# EAGLE design Chroma-Color_Rails (EAGLE 6.5.0)
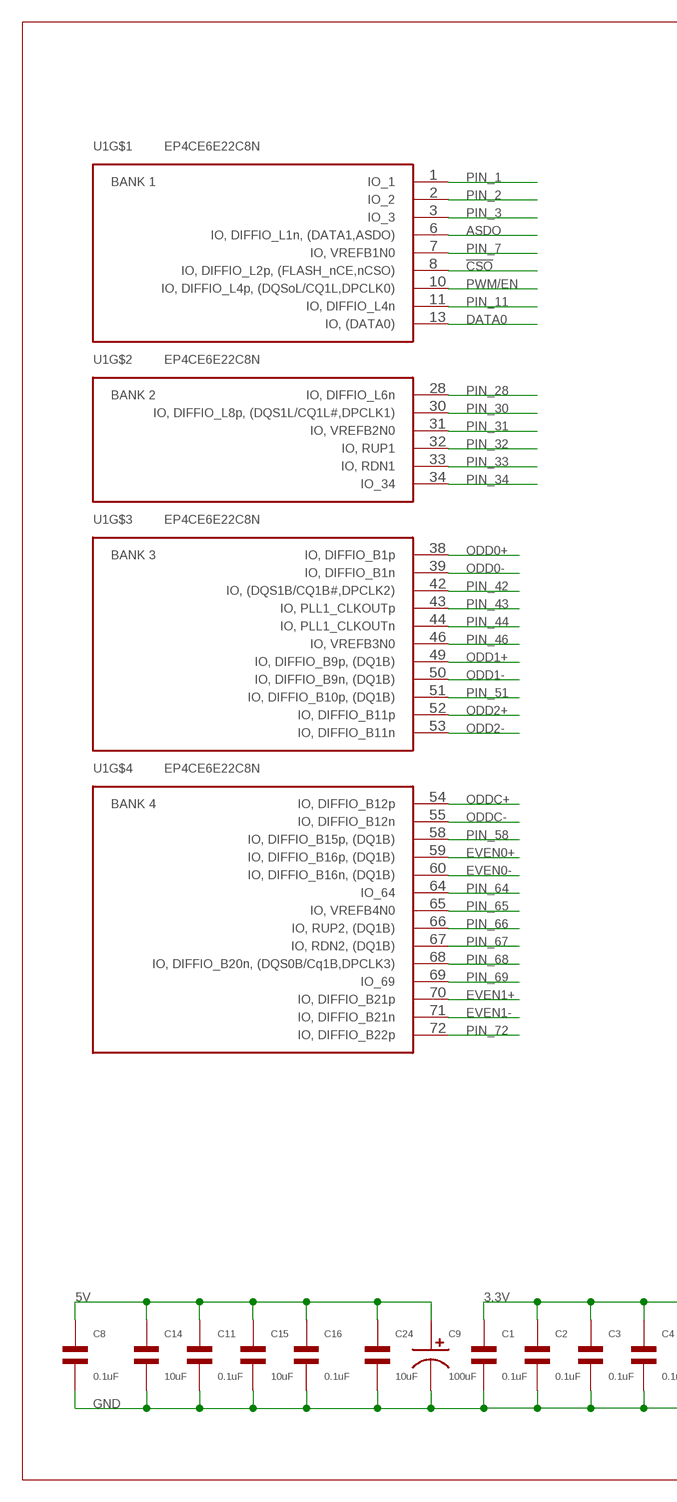
[diagram p0: schematic, sheet 1, part 1 of 2]
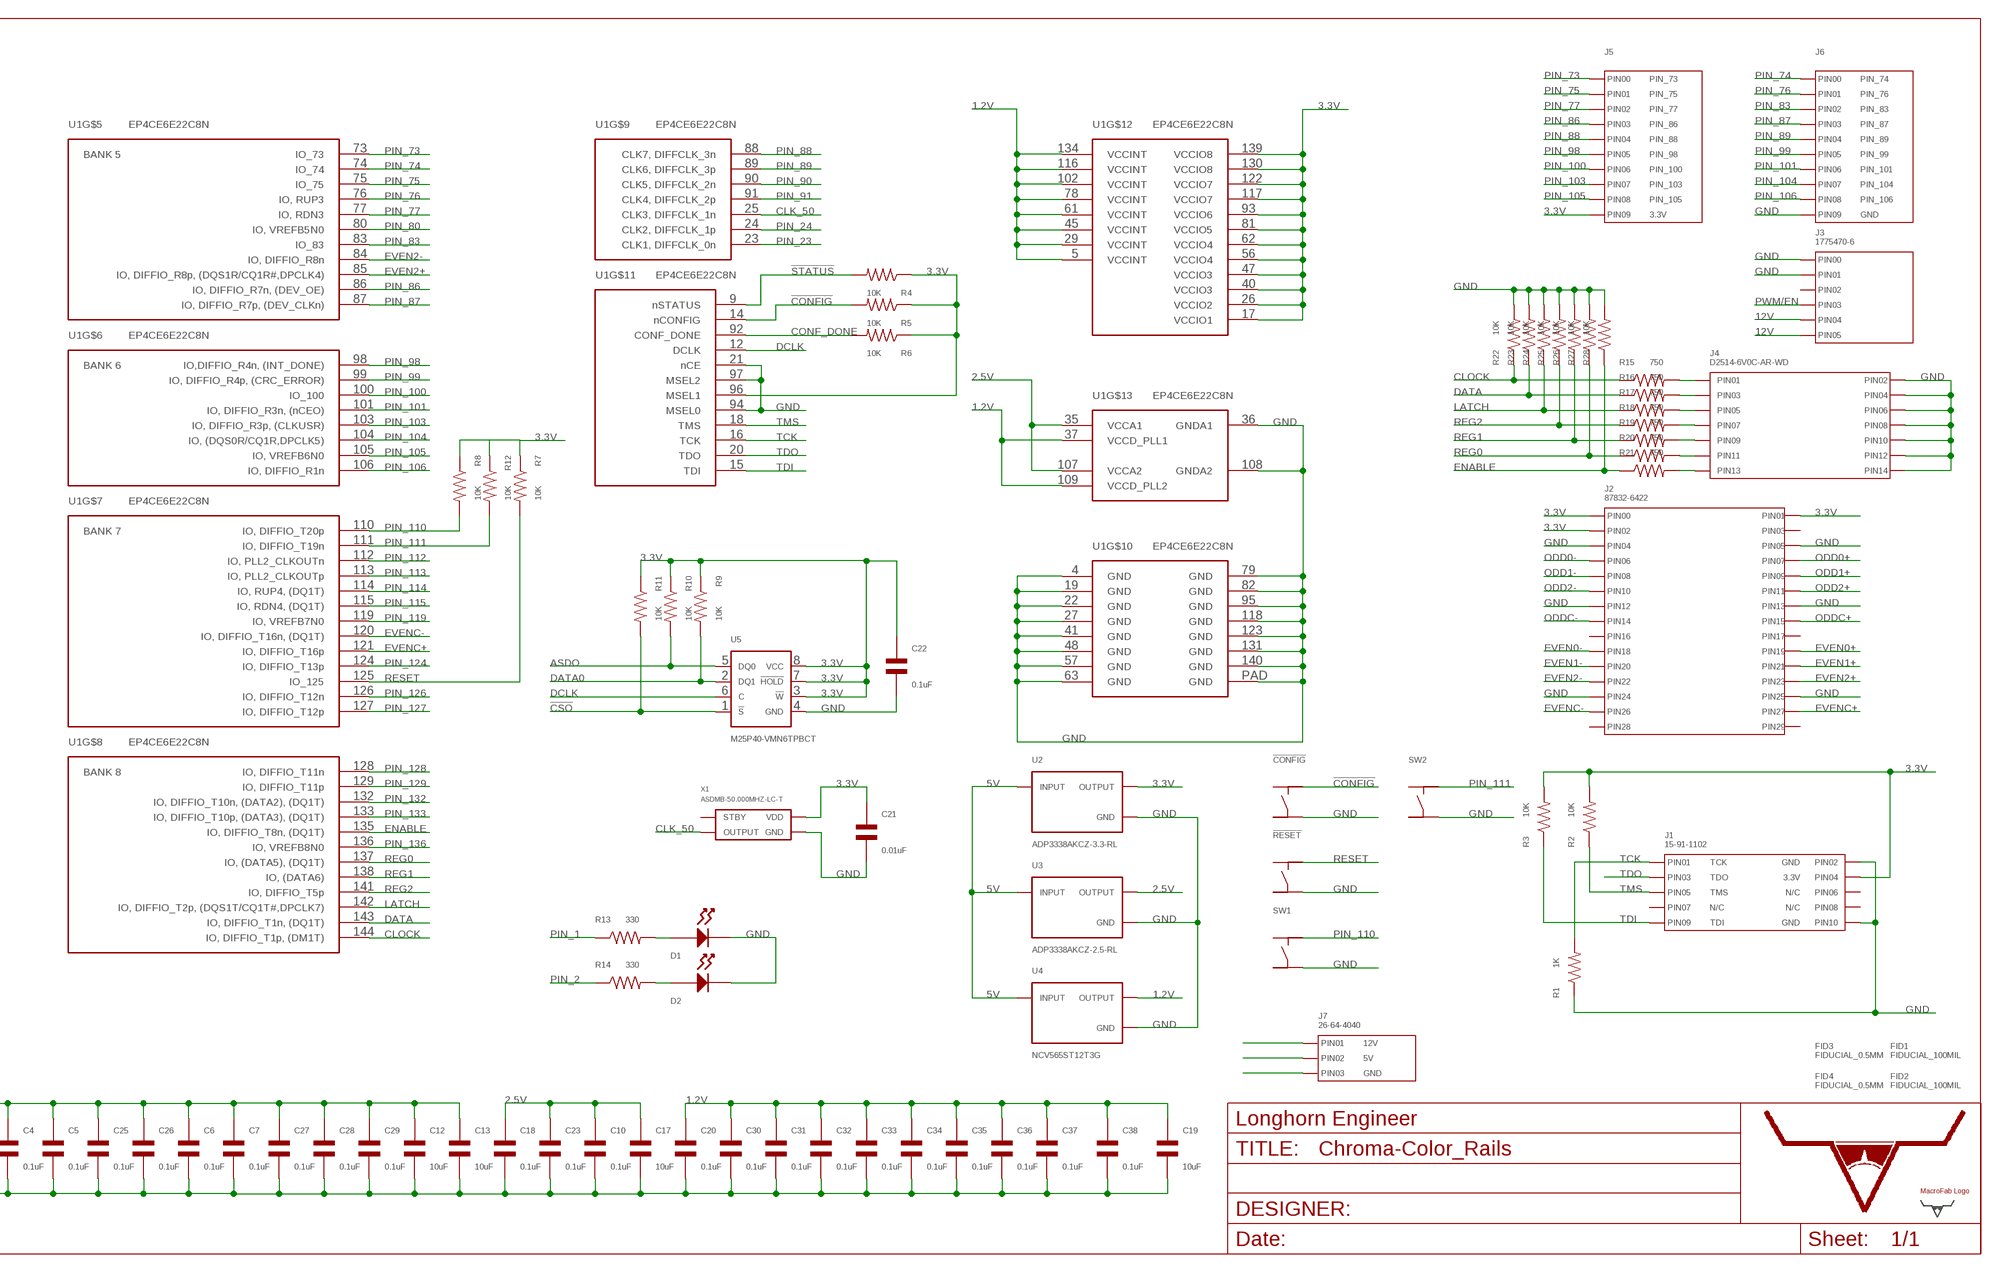
[diagram p1: schematic, sheet 1, part 2 of 2]

## Parts
!CONFIG  TACT_4.2MM  [TACT4.2MM]
!RESET  TACT_4.2MM  [TACT4.2MM]
C1  0.1uF  CAPACITOR_NP_0603  [C0603]
C2  0.1uF  CAPACITOR_NP_0603  [C0603]
C3  0.1uF  CAPACITOR_NP_0603  [C0603]
C4  0.1uF  CAPACITOR_NP_0603  [C0603]
C5  0.1uF  CAPACITOR_NP_0603  [C0603]
C6  0.1uF  CAPACITOR_NP_0603  [C0603]
C7  0.1uF  CAPACITOR_NP_0603  [C0603]
C8  0.1uF  CAPACITOR_NP_0603  [C0603]
C9  100uF  CAPACITOR_P_6.3MM  [CP6.3MM]
C10  0.1uF  CAPACITOR_NP_0603  [C0603]
C11  0.1uF  CAPACITOR_NP_0603  [C0603]
C12  10uF  CAPACITOR_NP_0603  [C0603]
C13  10uF  CAPACITOR_NP_0603  [C0603]
C14  10uF  CAPACITOR_NP_0603  [C0603]
C15  10uF  CAPACITOR_NP_0603  [C0603]
C16  0.1uF  CAPACITOR_NP_0603  [C0603]
C17  10uF  CAPACITOR_NP_0603  [C0603]
C18  0.1uF  CAPACITOR_NP_0603  [C0603]
C19  10uF  CAPACITOR_NP_0603  [C0603]
C20  0.1uF  CAPACITOR_NP_0603  [C0603]
C21  0.01uF  CAPACITOR_NP_0603  [C0603]
C22  0.1uF  CAPACITOR_NP_0603  [C0603]
C23  0.1uF  CAPACITOR_NP_0603  [C0603]
C24  10uF  CAPACITOR_NP_0603  [C0603]
C25  0.1uF  CAPACITOR_NP_0603  [C0603]
C26  0.1uF  CAPACITOR_NP_0603  [C0603]
C27  0.1uF  CAPACITOR_NP_0603  [C0603]
C28  0.1uF  CAPACITOR_NP_0603  [C0603]
C29  0.1uF  CAPACITOR_NP_0603  [C0603]
C30  0.1uF  CAPACITOR_NP_0603  [C0603]
C31  0.1uF  CAPACITOR_NP_0603  [C0603]
C32  0.1uF  CAPACITOR_NP_0603  [C0603]
C33  0.1uF  CAPACITOR_NP_0603  [C0603]
C34  0.1uF  CAPACITOR_NP_0603  [C0603]
C35  0.1uF  CAPACITOR_NP_0603  [C0603]
C36  0.1uF  CAPACITOR_NP_0603  [C0603]
C37  0.1uF  CAPACITOR_NP_0603  [C0603]
C38  0.1uF  CAPACITOR_NP_0603  [C0603]
D1  LED_SINGLE_0805  [LED0805]
D2  LED_SINGLE_0805  [LED0805]
FID1  FIDUCIAL_100MIL  [FIDUCIAL_100MIL]
FID2  FIDUCIAL_100MIL  [FIDUCIAL_100MIL]
FID3  FIDUCIAL_0.5MM  [FIDUCIAL_0.5MM]
FID4  FIDUCIAL_0.5MM  [FIDUCIAL_0.5MM]
J1  15-91-1102  [15-91-1102]
J2  87832-6422  [87832-6422]
J3  1775470-6  [1775470-6]
J4  D2514-6V0C-AR-WD  SMT_02X07D2514-6V0C-AR-WD  [D2514-6V0C-AR-WD]
J5  HEADER_01X10_PTH_2.54MM  [PTH_2.54MM_01X10]
J6  HEADER_01X10_PTH_2.54MM  [PTH_2.54MM_01X10]
J7  26-64-4040  HEADER_01X03MOLEX_KK_4_P1  [MOLEX_KK_4_P1]
R1  1K  RESISTOR_0603  [R0603]
R2  10K  RESISTOR_0603  [R0603]
R3  10K  RESISTOR_0603  [R0603]
R4  10K  RESISTOR_0603  [R0603]
R5  10K  RESISTOR_0603  [R0603]
R6  10K  RESISTOR_0603  [R0603]
R7  10K  RESISTOR_0603  [R0603]
R8  10K  RESISTOR_0603  [R0603]
R9  10K  RESISTOR_0603  [R0603]
R10  10K  RESISTOR_0603  [R0603]
R11  10K  RESISTOR_0603  [R0603]
R12  10K  RESISTOR_0603  [R0603]
R13  330  RESISTOR_0603  [R0603]
R14  330  RESISTOR_0603  [R0603]
R15  750  RESISTOR_0603  [R0603]
R16  750  RESISTOR_0603  [R0603]
R17  750  RESISTOR_0603  [R0603]
R18  750  RESISTOR_0603  [R0603]
R19  750  RESISTOR_0603  [R0603]
R20  750  RESISTOR_0603  [R0603]
R21  750  RESISTOR_0603  [R0603]
R22  10K  RESISTOR_0603  [R0603]
R23  10K  RESISTOR_0603  [R0603]
R24  10K  RESISTOR_0603  [R0603]
R25  10K  RESISTOR_0603  [R0603]
R26  10K  RESISTOR_0603  [R0603]
R27  10K  RESISTOR_0603  [R0603]
R28  10K  RESISTOR_0603  [R0603]
SW1  TACT_4.2MM  [TACT4.2MM]
SW2  TACT_4.2MM  [TACT4.2MM]
U1  EP4CE6E22C8N  [EQFP-144]
U2  ADP3338AKCZ-3.3-RL  [SOT-223B]
U3  ADP3338AKCZ-2.5-RL  [SOT-223B]
U4  NCV565ST12T3G  [SOT-223B]
U5  M25P40-VMN6TPBCT  [SOIC-8]
U$1  LHE_FRAME  [LHE_FRAME]
U$2  MF_LOGOLOGO_MEDIUM  [MF_LOGO_MEDIUM]
U$3  LHE_LOGOLHE_LOGO  [LHE_LOGO]
X1  ASDMB-50.000MHZ-LC-T  ASDMB  [ASDMB]

## Nets
1.2V: C19.P$1 C20.P$1 C30.P$1 C31.P$1 C32.P$1 C33.P$1 C34.P$1 C35.P$1 C36.P$1 C37.P$1 C38.P$1 U1.5 U1.29 U1.37 U1.45 U1.61 U1.78 U1.102 U1.109 U1.116 U1.134 U4.2(OUT) U4.PAD(OUT)
2.5V: C10.P$1 C17.P$1 C18.P$1 C23.P$1 U1.35 U1.107 U3.2(OUT) U3.PAD(OUT)
3.3V: C1.P$1 C2.P$1 C3.P$1 C4.P$1 C5.P$1 C6.P$1 C7.P$1 C12.P$1 C13.P$1 C21.P$1 C22.P$1 C25.P$1 C26.P$1 C27.P$1 C28.P$1 C29.P$1 J1.4(PIN4) J2.P$1(PIN0) J2.P$2(PIN1) J2.P$3(PIN2) J5.P$10(PIN9) R2.P$2 R3.P$2 R4.P$1 R5.P$1 R6.P$1 R7.P$1 R8.P$1 R9.P$1 R10.P$1 R11.P$1 R12.P$1 U1.17 U1.26 U1.40 U1.47 U1.56 U1.62 U1.81 U1.93 U1.96 U1.117 U1.122 U1.130 U1.139 U2.2(OUT) U2.PAD(OUT) U5.3(!W) U5.7(!HOLD) U5.8(VCC) X1.P$4(VDD)
5V: C8.P$1 C9.P$1 C11.P$1 C14.P$1 C15.P$1 C16.P$1 C24.P$1 J7.3(PIN2) U2.3(IN) U3.3(IN) U4.3(IN)
12V: J3.P$5(PIN4) J3.P$6(PIN5) J7.2(PIN1)
!CONFIG: !CONFIG.P$2 R5.P$2 U1.14
!CSO: R11.P$2 U1.8 U5.1(!S)
!STATUS: R4.P$2 U1.9
ASDO: R10.P$2 U1.6 U5.5(DQ0)
CLK_50: U1.25 X1.P$3(OUTPUT)
CLOCK: R15.P$1 R22.P$1 U1.144
CONF_DONE: R6.P$2 U1.92
DATA: R16.P$1 R23.P$1 U1.143
DATA0: R9.P$2 U1.13 U5.2(DQ1)
DCLK: U1.12 U5.6(C)
ENABLE: R21.P$1 R28.P$1 U1.135
EVEN0+: J2.P$20(PIN19) U1.59
EVEN0-: J2.P$19(PIN18) U1.60
EVEN1+: J2.P$22(PIN21) U1.70
EVEN1-: J2.P$21(PIN20) U1.71
EVEN2+: J2.P$24(PIN23) U1.85
EVEN2-: J2.P$23(PIN22) U1.84
EVENC+: J2.P$28(PIN27) U1.121
EVENC-: J2.P$27(PIN26) U1.120
GND: !CONFIG.P$4 !RESET.P$4 C1.P$2 C2.P$2 C3.P$2 C4.P$2 C5.P$2 C6.P$2 C7.P$2 C8.P$2 C9.P$2 C10.P$2 C11.P$2 C12.P$2 C13.P$2 C14.P$2 C15.P$2 C16.P$2 C17.P$2 C18.P$2 C19.P$2 C20.P$2 C21.P$2 C22.P$2 C23.P$2 C24.P$2 C25.P$2 C26.P$2 C27.P$2 C28.P$2 C29.P$2 C30.P$2 C31.P$2 C32.P$2 C33.P$2 C34.P$2 C35.P$2 C36.P$2 C37.P$2 C38.P$2 D1.CATHODE D2.CATHODE J1.2(PIN2) J1.10(PIN10) J2.P$5(PIN4) J2.P$6(PIN5) J2.P$13(PIN12) J2.P$14(PIN13) J2.P$25(PIN24) J2.P$26(PIN25) J3.P$1(PIN0) J3.P$2(PIN1) J4.2(PIN2) J4.4(PIN4) J4.6(PIN6) J4.8(PIN8) J4.10(PIN10) J4.12(PIN12) J4.14(PIN14) J6.P$10(PIN9) J7.4(PIN3) R1.P$1 R22.P$2 R23.P$2 R24.P$2 R25.P$2 R26.P$2 R27.P$2 R28.P$2 SW1.P$4 SW2.P$4 U1.4 U1.19 U1.21 U1.22 U1.27 U1.36 U1.41 U1.48 U1.57 U1.63 U1.79 U1.82 U1.94 U1.95 U1.97 U1.108 U1.118 U1.123 U1.131 U1.140 U1.PAD U2.1(GND) U3.1(GND) U4.1(GND) U5.4(GND) X1.P$2(GND)
LATCH: R17.P$1 R24.P$1 U1.142
N$1: D1.ANODE R13.P$2
N$2: D2.ANODE R14.P$2
N$3: J4.1(PIN1) R15.P$2
N$4: J4.3(PIN3) R16.P$2
N$5: J4.5(PIN5) R17.P$2
N$6: J4.7(PIN7) R18.P$2
N$7: J4.9(PIN9) R19.P$2
N$8: J4.11(PIN11) R20.P$2
N$9: J4.13(PIN13) R21.P$2
ODD0+: J2.P$8(PIN7) U1.38
ODD0-: J2.P$7(PIN6) U1.39
ODD1+: J2.P$10(PIN9) U1.49
ODD1-: J2.P$9(PIN8) U1.50
ODD2+: J2.P$12(PIN11) U1.52
ODD2-: J2.P$11(PIN10) U1.53
ODDC+: J2.P$16(PIN15) U1.54
ODDC-: J2.P$15(PIN14) U1.55
PIN_1: R13.P$1 U1.1
PIN_2: R14.P$1 U1.2
PIN_3: U1.3
PIN_7: U1.7
PIN_11: U1.11
PIN_23: U1.23
PIN_24: U1.24
PIN_28: U1.28
PIN_30: U1.30
PIN_31: U1.31
PIN_32: U1.32
PIN_33: U1.33
PIN_34: U1.34
PIN_42: U1.42
PIN_43: U1.43
PIN_44: U1.44
PIN_46: U1.46
PIN_51: U1.51
PIN_58: U1.58
PIN_64: U1.64
PIN_65: U1.65
PIN_66: U1.66
PIN_67: U1.67
PIN_68: U1.68
PIN_69: U1.69
PIN_72: U1.72
PIN_73: J5.P$1(PIN0) U1.73
PIN_74: J6.P$1(PIN0) U1.74
PIN_75: J5.P$2(PIN1) U1.75
PIN_76: J6.P$2(PIN1) U1.76
PIN_77: J5.P$3(PIN2) U1.77
PIN_80: U1.80
PIN_83: J6.P$3(PIN2) U1.83
PIN_86: J5.P$4(PIN3) U1.86
PIN_87: J6.P$4(PIN3) U1.87
PIN_88: J5.P$5(PIN4) U1.88
PIN_89: J6.P$5(PIN4) U1.89
PIN_90: U1.90
PIN_91: U1.91
PIN_98: J5.P$6(PIN5) U1.98
PIN_99: J6.P$6(PIN5) U1.99
PIN_100: J5.P$7(PIN6) U1.100
PIN_101: J6.P$7(PIN6) U1.101
PIN_103: J5.P$8(PIN7) U1.103
PIN_104: J6.P$8(PIN7) U1.104
PIN_105: J5.P$9(PIN8) U1.105
PIN_106: J6.P$9(PIN8) U1.106
PIN_110: R8.P$2 SW1.P$2 U1.110
PIN_111: R12.P$2 SW2.P$2 U1.111
PIN_112: U1.112
PIN_113: U1.113
PIN_114: U1.114
PIN_115: U1.115
PIN_119: U1.119
PIN_124: U1.124
PIN_126: U1.126
PIN_127: U1.127
PIN_128: U1.128
PIN_129: U1.129
PIN_132: U1.132
PIN_133: U1.133
PIN_136: U1.136
PWM/EN: J3.P$4(PIN3) U1.10
REG0: R20.P$1 R27.P$1 U1.137
REG1: R19.P$1 R26.P$1 U1.138
REG2: R18.P$1 R25.P$1 U1.141
RESET: !RESET.P$2 R7.P$2 U1.125
TCK: J1.1(PIN1) R1.P$2 U1.16
TDI: J1.9(PIN9) R3.P$1 U1.15
TDO: J1.3(PIN3) U1.20
TMS: J1.5(PIN5) R2.P$1 U1.18
Unconnected: !CONFIG.P$1 !CONFIG.P$3 !RESET.P$1 !RESET.P$3 J1.6(PIN6) J1.7(PIN7) J1.8(PIN8) J2.P$4(PIN3) J2.P$17(PIN16) J2.P$18(PIN17) J2.P$29(PIN28) J2.P$30(PIN29) J3.P$3(PIN2) SW1.P$1 SW1.P$3 SW2.P$1 SW2.P$3 X1.P$1(STBY)

## Library data of the parts
!CONFIG !RESET SW1 SW2 = MF_Switches:TACT: Library: MF_Switches Description: Device for Tact Switches. Manufacture part number (MFG#) can be added via Attributes.
C1-C8 C10-C38 = MF_Passives:CAPACITOR_NP: Library: MF_Passives Description: Device for Non-Polarized Capacitors. Manufacture part number (MFG#), Voltage, Temperature Coefficient, and Tolerance can be added via Attributes.; MFG#: N/A; TEMP_COF: N/A; TOLERANCE: N/A; VOLTAGE: N/A
C9 = MF_Passives:CAPACITOR_P: Library: MF_Passives Description: Device for Polarized Capacitors. Manufacture part number (MFG#), Voltage Rating, and Tolerance can be added via Attributes.; MFG#: N/A; TOLERANCE: N/A; VOTLAGE: N/A
D1 D2 = MF_LEDs:LED_SINGLE: Library: MF_LEDs Description: Device for Single LED Packages. Manufacture part number (MFG#) can be added via Attributes.
FID1-FID4 = MF_Aesthetics:FIDUCIAL: Library: MF_Aesthetics Description: Fiducial marking for PCB alignment inside PNP and other machines.
J1 = PP_Connectors:15-91-1102; LABEL01: TCK; LABEL02: GND; LABEL03: TDO; LABEL04: 3.3V; LABEL05: TMS; LABEL06: N/C; LABEL07: N/C; LABEL08: N/C; LABEL09: TDI; LABEL10: GND
J2 = PP_Connectors:87832-6422
J3 = PP_Connectors:1775470-6
J4 = PP_Connectors:SMT_02X07
J5 = MF_Connectors:HEADER_01X10: Library: MF_Connectors Description: Header Connector with 10 Positions and 01 Rows. Use the LABEL Attribute to label the pin on the schematic and PCB. You can remove the attributes on the PCB by using the SMASH function on the part and then deleting the text.; LABEL00: PIN_73; LABEL01: PIN_75; LABEL02: PIN_77; LABEL03: PIN_86; LABEL04: PIN_88; LABEL05: PIN_98; LABEL06: PIN_100; LABEL07: PIN_103; LABEL08: PIN_105; LABEL09: 3.3V
J6 = MF_Connectors:HEADER_01X10: Library: MF_Connectors Description: Header Connector with 10 Positions and 01 Rows. Use the LABEL Attribute to label the pin on the schematic and PCB. You can remove the attributes on the PCB by using the SMASH function on the part and then deleting the text.; LABEL00: PIN_74; LABEL01: PIN_76; LABEL02: PIN_83; LABEL03: PIN_87; LABEL04: PIN_89; LABEL05: PIN_99; LABEL06: PIN_101; LABEL07: PIN_104; LABEL08: PIN_106; LABEL09: GND
J7 = PP_Connectors:HEADER_01X03: 3 pin connectors; LABEL01: 12V; LABEL02: 5V; LABEL03: GND
R1-R28 = MF_Passives:RESISTOR: Library: MF_Passives Description: Device for Resistors. Manufacture part number (MFG#), Voltage, Tolerance, and Wattage Rating can be added via Attributes.; MFG#: N/A; TOLERANCE: N/A; VOLTAGE: N/A; WATTAGE: N/A
U1 = PP_DigitalIC:EP4CE6E22C8N: Manufacturer Part #: EP4CE6E22C8N Manufacturer: Altera Description: FPGA - Field Programmable Gate Array FPGA - Cyclone IV E 392 LABs 91 IOs URL: http://www.mouser.com/ds/2/591/cyiv-51001-472857.pdf
U2 U3 = PP_PowerIC:ADP3338
U4 = PP_PowerIC:NCV565
U5 = PP_DigitalIC:M25P40
U$1 = PP_Aesthetics:LHE_FRAME; DNAME: Parker Dillmann; REVNUM: REV: 2
U$2 = PP_Aesthetics:MF_LOGO
U$3 = PP_Aesthetics:LHE_LOGO
X1 = PP_FreqCtrl:ASDMB

## Board
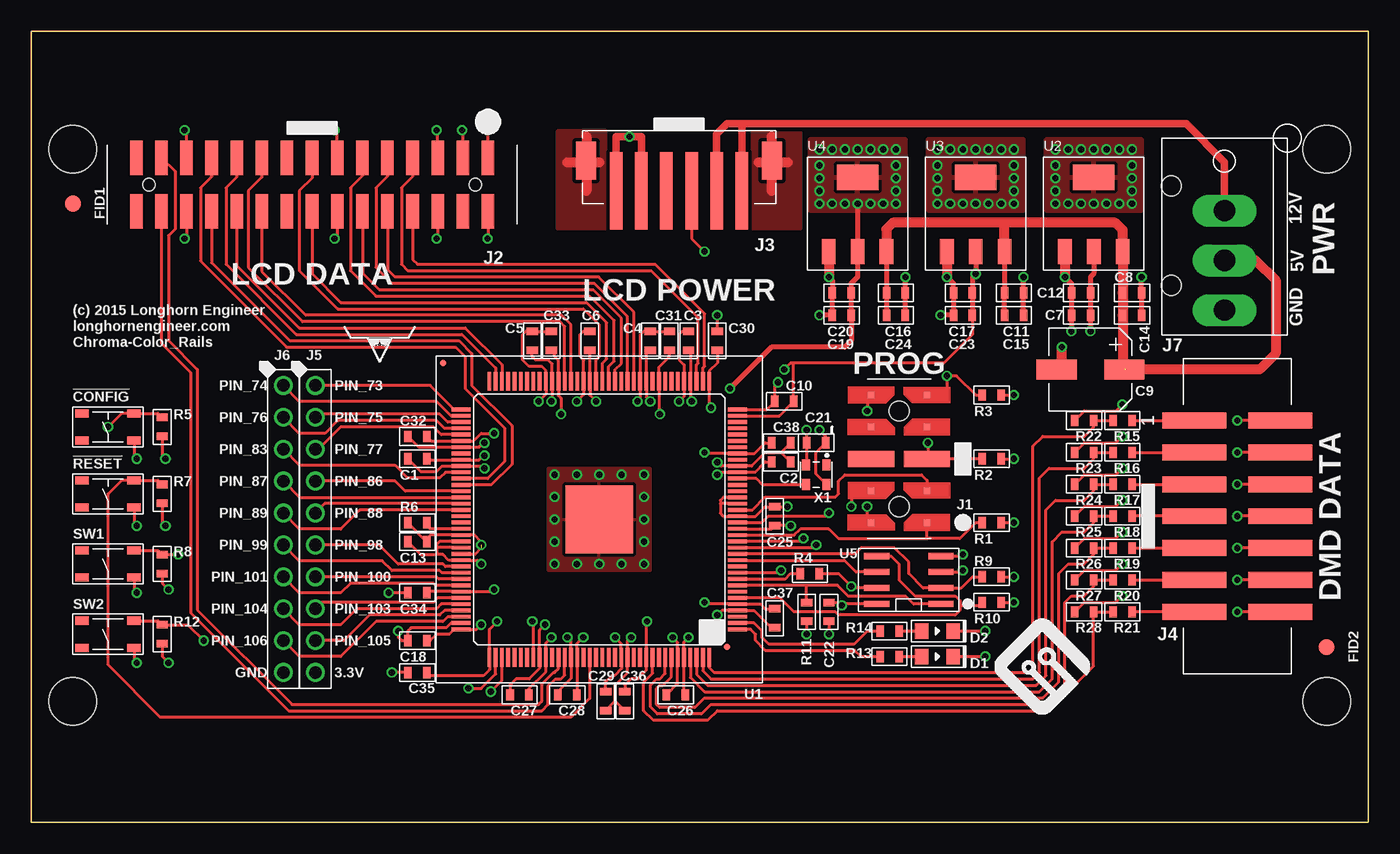
[diagram p2: board, top side]
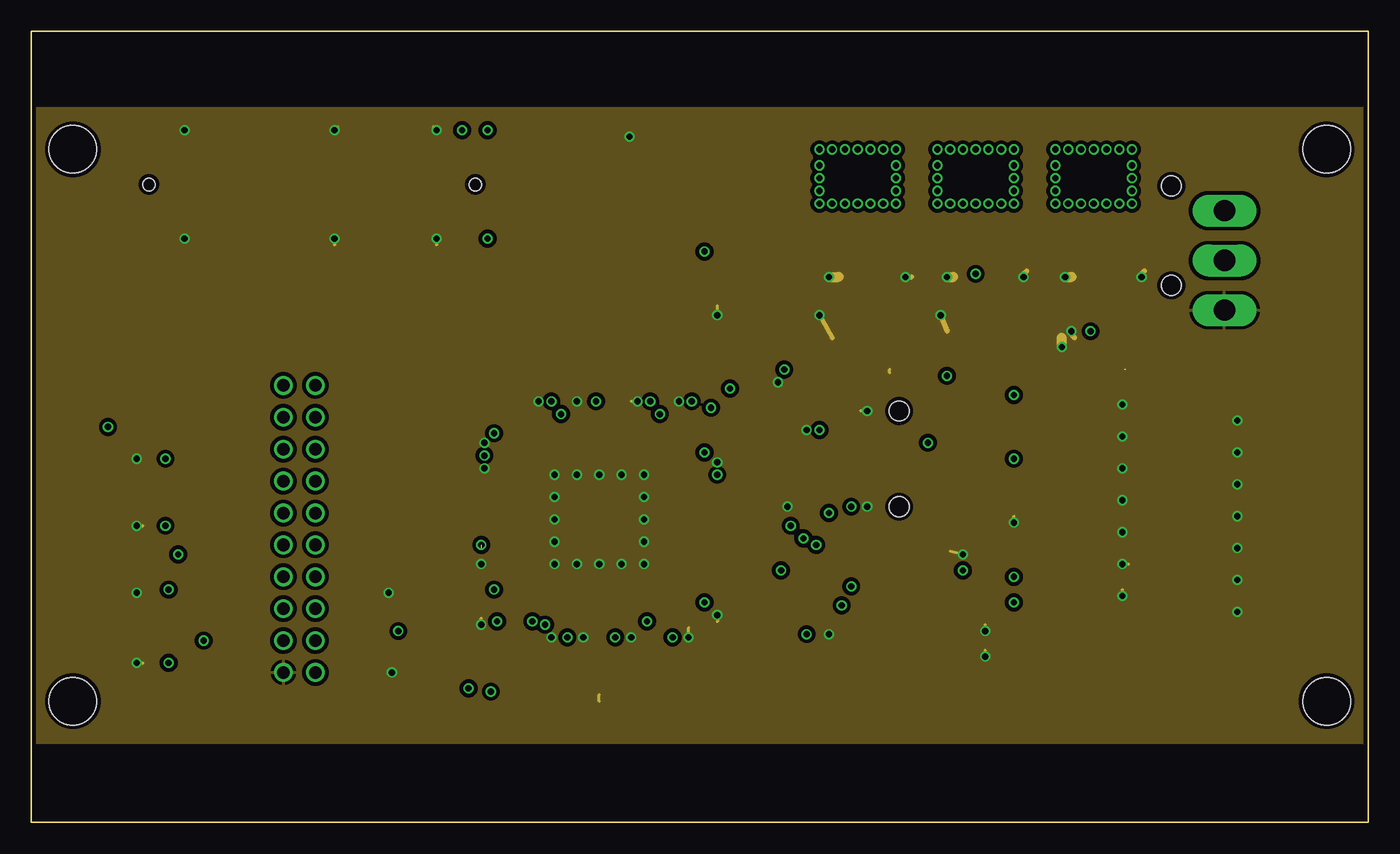
[diagram p3: board, inner layer Route2]
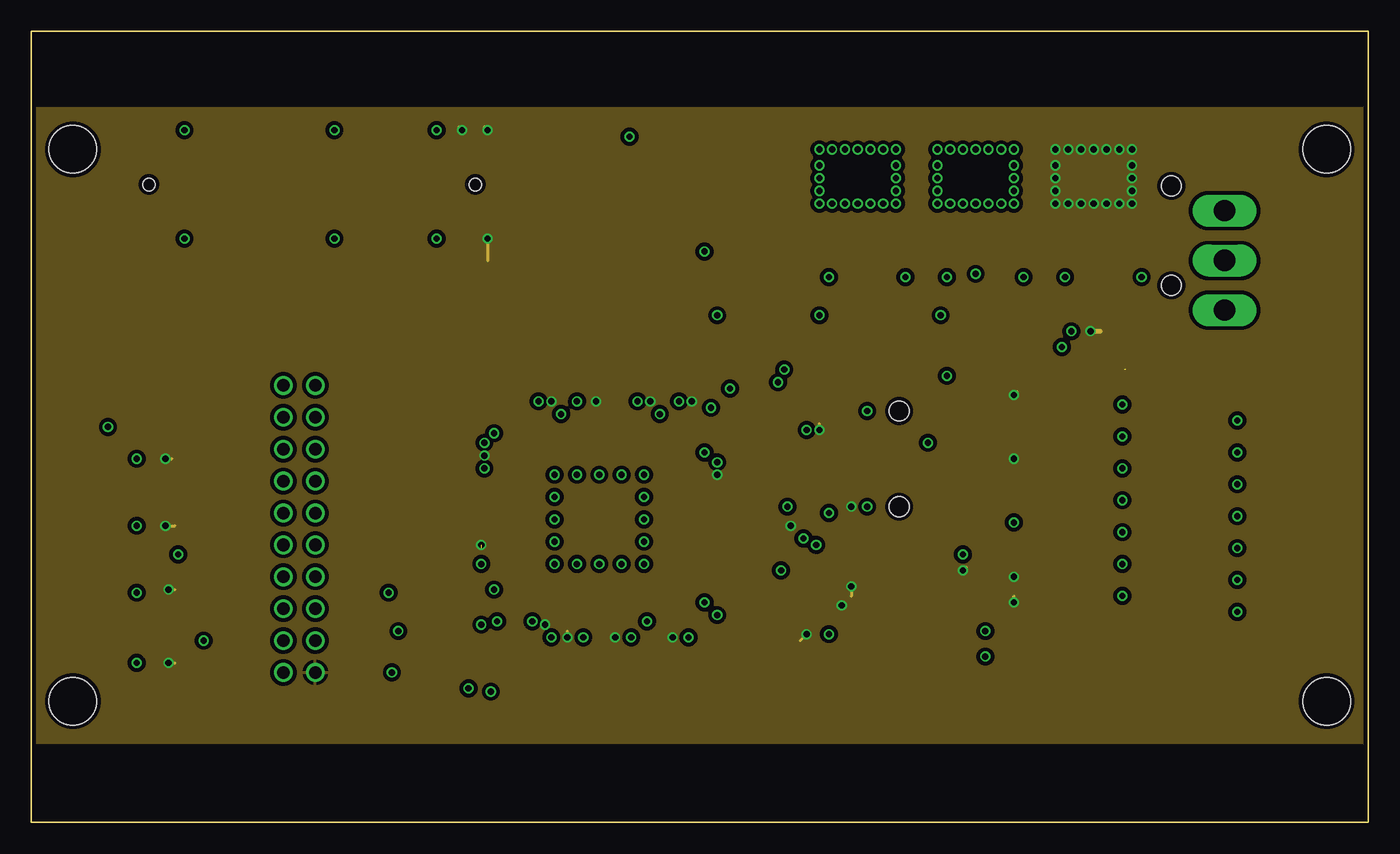
[diagram p4: board, inner layer Route15]
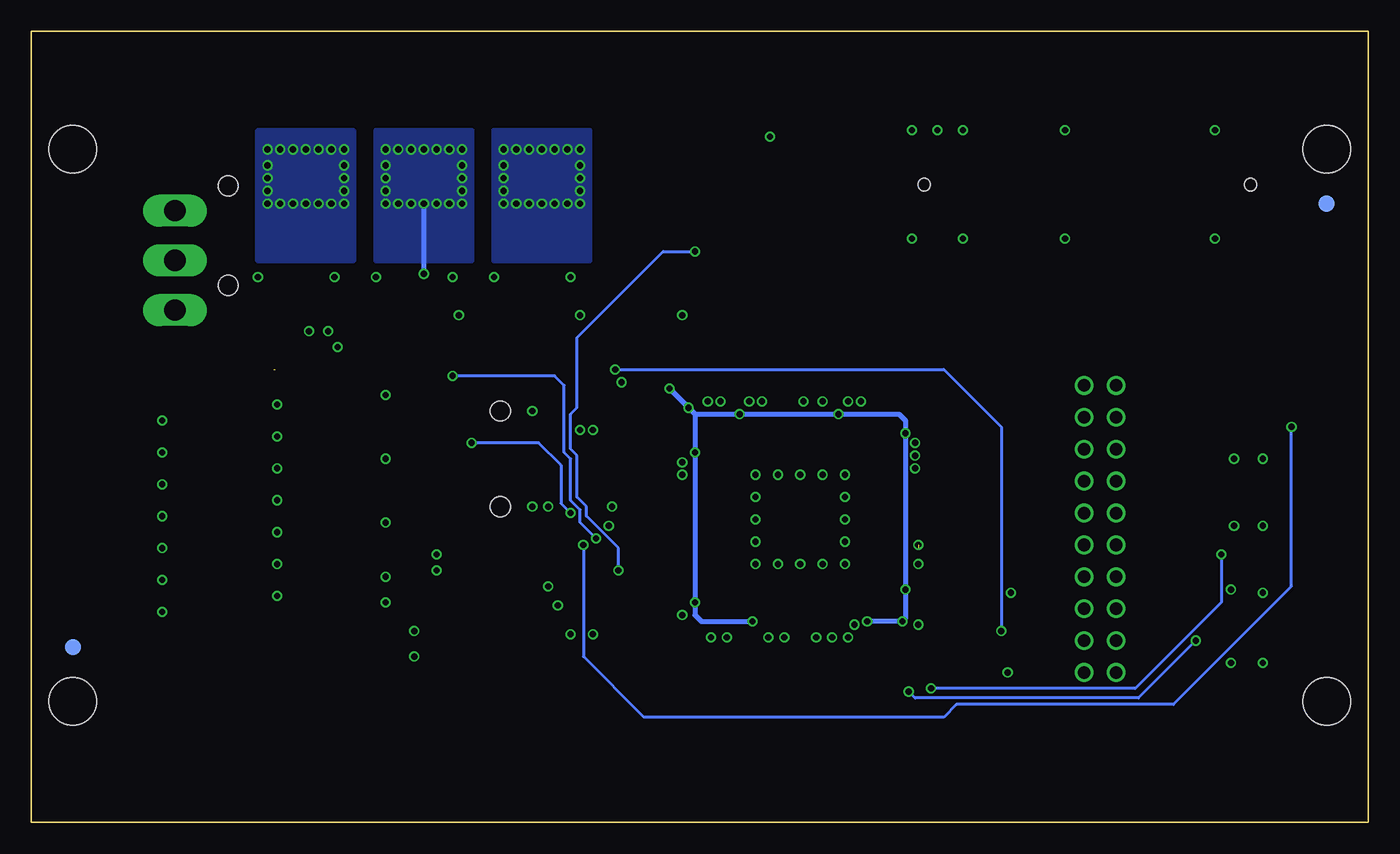
[diagram p5: board, bottom side, seen from below]

Size 106.43 x 62.99 mm. Coordinates in mm from the lower left corner, seen from the top.
Outline: 0,6.35 0,56.9
Outline: 106.43,56.9 106.43,6.35
Outline: 0,0 0,62.99 106.43,62.99 106.43,0 0,0
Copper layers (1*2*15*16): Top 0.035mm / dielectric 0.2mm / Route2 0.0175mm / dielectric 1.1mm / Route15 0.0175mm / dielectric 0.2mm / Bottom 0.035mm
Design rules "Seeed_4_Layer_DRU": minimum track width 6mil, minimum drill 12mil, track to track 6mil, track to pad 6mil, pad to pad 6mil, via to via 6mil, smd to smd 0mil, copper to edge 10mil, drill to drill 10mil, minimum pad ring 6mil, minimum via ring 6mil, stop-mask expansion 2mil, vias tented up to drill 25mil, thermal gap 10mil
Holes 3.8 mm at 3.3,9.65 103.12,9.65 103.12,53.59 3.3,53.59

### Footprints (pad centres in the part's own frame; a part is rotated, then mirrored left to right if it is on the bottom)
TACT4.2MM = smd 1.05 x 0.65: P$1 -2.075,1.075; P$2 2.075,1.075; P$3 -2.075,-1.075; P$4 2.075,-1.075
C0603 = smd 0.6 x 0.9: P$1 -0.75,0; P$2 0.75,0
CP6.3MM = smd 1.6 x 3.2: P$1 0,-2.7; P$2 0,2.7
LED0805 = smd 1.1 x 1.25: ANODE 1.25,0; CATHODE -1.25,0
FIDUCIAL_100MIL = smd 1.27 x 1.27: P$1 0,0 | smd 1.27 x 1.27 bottom: P$2 0,0
FIDUCIAL_0.5MM = smd 0.5 x 0.5: FID 0,0
15-91-1102 = smd 0.5 x 0.5: 1 -5.08,-2.22; 2 -5.08,2.22; 3 -2.54,-2.22; 4 -2.54,2.22; 7 2.54,-2.22; 8 2.54,2.22; 9 5.08,-2.22; 10 5.08,2.22 | smd 1.27 x 3.68: 5 0,-2.22; 6 0,2.22 | hole 1.6: -3.81,0; 3.81,0
87832-6422 = smd 1 x 2.75: P$1 -14,-2.125; P$2 -14,2.125; P$3 -12,-2.125; P$4 -12,2.125; P$5 -10,-2.125; P$6 -10,2.125; P$7 -8,-2.125; P$8 -8,2.125; P$9 -6,-2.125; P$10 -6,2.125; P$11 -4,-2.125; P$12 -4,2.125; P$13 -2,-2.125; P$14 -2,2.125; P$15 0,-2.125; P$16 0,2.125; P$17 2,-2.125; P$18 2,2.125; P$19 4,-2.125; P$20 4,2.125; P$21 6,-2.125; P$22 6,2.125; P$23 8,-2.125; P$24 8,2.125; P$25 10,-2.125; P$26 10,2.125; P$27 12,-2.125; P$28 12,2.125; P$29 14,-2.125; P$30 14,2.125 | hole 1: -13,0; 13,0
1775470-6 = smd 1 x 6.2: P$1 5,0; P$2 3,0; P$3 1,0; P$4 -1,0; P$5 -3,0; P$6 -5,0 | smd 1.6 x 3: S0 -7.4,-2.4; S1 7.4,-2.4
D2514-6V0C-AR-WD = smd 1.27 x 5.08: 1 -7.62,-3.429; 2 -7.62,3.429; 3 -5.08,-3.429; 4 -5.08,3.429; 5 -2.54,-3.429; 6 -2.54,3.429; 7 0,-3.429; 8 0,3.429; 9 2.54,-3.429; 10 2.54,3.429; 11 5.08,-3.429; 12 5.08,3.429; 13 7.62,-3.429; 14 7.62,3.429
PTH_2.54MM_01X10 = drill 1: P$1 -11.43,0; P$2 -8.89,0; P$3 -6.35,0; P$4 -3.81,0; P$5 -1.27,0; P$6 1.27,0; P$7 3.81,0; P$8 6.35,0; P$9 8.89,0; P$10 11.43,0
MOLEX_KK_4_P1 = drill 1.702 long: 2 -1.98,0; 3 1.98,0; 4 5.94,0 | hole 1.6: 3.96,-4.24; -3.96,-4.24
R0603 = smd 0.6 x 0.9: P$1 -0.75,0; P$2 0.75,0
EQFP-144 = smd 1.5 x 0.3: 1 -11,8.75; 2 -11,8.25; 3 -11,7.75; 4 -11,7.25; 5 -11,6.75; 6 -11,6.25; 7 -11,5.75; 8 -11,5.25; 9 -11,4.75; 10 -11,4.25; 11 -11,3.75; 12 -11,3.25; 13 -11,2.75; 14 -11,2.25; 15 -11,1.75; 16 -11,1.25; 17 -11,0.75; 18 -11,0.25; 19 -11,-0.25; 20 -11,-0.75; 21 -11,-1.25; 22 -11,-1.75; 23 -11,-2.25; 24 -11,-2.75; 25 -11,-3.25; 26 -11,-3.75; 27 -11,-4.25; 28 -11,-4.75; 29 -11,-5.25; 30 -11,-5.75; 31 -11,-6.25; 32 -11,-6.75; 33 -11,-7.25; 34 -11,-7.75; 35 -11,-8.25; 36 -11,-8.75; 73 11,-8.75; 74 11,-8.25; 75 11,-7.75; 76 11,-7.25; 77 11,-6.75; 78 11,-6.25; 79 11,-5.75; 80 11,-5.25; 81 11,-4.75; 82 11,-4.25; 83 11,-3.75; 84 11,-3.25; 85 11,-2.75; 86 11,-2.25; 87 11,-1.75; 88 11,-1.25; 89 11,-0.75; 90 11,-0.25; 91 11,0.25; 92 11,0.75; 93 11,1.25; 94 11,1.75; 95 11,2.25; 96 11,2.75; 97 11,3.25; 98 11,3.75; 99 11,4.25; 100 11,4.75; 101 11,5.25; 102 11,5.75; 103 11,6.25; 104 11,6.75; 105 11,7.25; 106 11,7.75; 107 11,8.25; 108 11,8.75 | smd 0.3 x 1.5: 37 -8.75,-11; 38 -8.25,-11; 39 -7.75,-11; 40 -7.25,-11; 41 -6.75,-11; 42 -6.25,-11; 43 -5.75,-11; 44 -5.25,-11; 45 -4.75,-11; 46 -4.25,-11; 47 -3.75,-11; 48 -3.25,-11; 49 -2.75,-11; 50 -2.25,-11; 51 -1.75,-11; 52 -1.25,-11; 53 -0.75,-11; 54 -0.25,-11; 55 0.25,-11; 56 0.75,-11; 57 1.25,-11; 58 1.75,-11; 59 2.25,-11; 60 2.75,-11; 61 3.25,-11; 62 3.75,-11; 63 4.25,-11; 64 4.75,-11; 65 5.25,-11; 66 5.75,-11; 67 6.25,-11; 68 6.75,-11; 69 7.25,-11; 70 7.75,-11; 71 8.25,-11; 72 8.75,-11; 109 8.75,11; 110 8.25,11; 111 7.75,11; 112 7.25,11; 113 6.75,11; 114 6.25,11; 115 5.75,11; 116 5.25,11; 117 4.75,11; 118 4.25,11; 119 3.75,11; 120 3.25,11; 121 2.75,11; 122 2.25,11; 123 1.75,11; 124 1.25,11; 125 0.75,11; 126 0.25,11; 127 -0.25,11; 128 -0.75,11; 129 -1.25,11; 130 -1.75,11; 131 -2.25,11; 132 -2.75,11; 133 -3.25,11; 134 -3.75,11; 135 -4.25,11; 136 -4.75,11; 137 -5.25,11; 138 -5.75,11; 139 -6.25,11; 140 -6.75,11; 141 -7.25,11; 142 -7.75,11; 143 -8.25,11; 144 -8.75,11 | smd 5.4 x 5.4: PAD 0,0
SOT-223B = smd 1.1 x 2: 1 -2.3,-2.54; 2 0,-2.54; 3 2.3,-2.54 | smd 3.3 x 2: PAD 0,3.36
SOIC-8 = smd 0.5 x 2: 1 -1.905,-2.55; 2 -0.635,-2.55; 3 0.635,-2.55; 4 1.905,-2.55; 5 1.905,2.55; 6 0.635,2.55; 7 -0.635,2.55; 8 -1.905,2.55
ASDMB = smd 0.65 x 0.85: P$1 -0.825,-0.775; P$2 0.825,-0.775; P$3 0.825,0.775; P$4 -0.825,0.775

### Placement (x,y rotation side)
!CONFIG  6.1,31.5 0 top
!RESET  6.1,26.16 0 top
C1  30.73,28.96 180 top
C2  59.69,28.7 0 top
C3  52.32,38.35 90 top
C4  49.28,38.35 90 top
C5  39.88,38.35 90 top
C6  44.45,38.35 90 top
C7  83.57,40.39 180 top
C8  87.63,42.16 0 top
C9  84.33,36.07 90 top
C10  59.94,33.53 180 top
C11  78.23,42.16 0 top
C12  83.57,42.16 180 top
C13  30.73,22.35 180 top
C14  87.63,40.39 0 top
C15  78.23,40.39 0 top
C16  68.83,42.16 0 top
C17  74.17,42.16 180 top
C18  30.73,14.48 0 top
C19  64.52,40.39 180 top
C20  64.52,42.16 180 top
C21  62.48,30.23 180 top
C22  63.5,16.76 270 top
C23  74.17,40.39 180 top
C24  68.83,40.39 0 top
C25  59.18,24.38 90 top
C26  51.31,10.16 0 top
C27  38.86,10.16 0 top
C28  42.67,10.16 0 top
C29  45.72,9.65 270 top
C30  54.61,38.35 90 top
C31  50.8,38.35 90 top
C32  30.73,30.73 180 top
C33  41.4,38.35 90 top
C34  30.73,18.29 180 top
C35  30.73,11.94 180 top
C36  47.24,9.65 270 top
C37  59.18,16.26 270 top
C38  59.69,30.23 0 top
D1  72.14,13.21 180 top
D2  72.14,15.24 180 top
FID1  3.3,49.28 270 top
FID2  103.12,13.97 270 top
FID3  32.77,36.58 0 top
FID4  55.37,13.97 0 top
J1  69.09,28.96 90 top
J2  22.35,50.8 180 top
J3  51.56,50.29 180 top
J4  96.01,24.38 270 top
J5  22.61,23.37 270 top
J6  20.07,23.37 270 top
J7  95,46.74 270 top
R1  76.45,23.88 180 top
R2  76.45,28.96 0 top
R3  76.45,34.04 0 top
R4  61.98,19.81 180 top
R5  10.41,31.5 90 top
R6  30.73,23.88 0 top
R7  10.41,26.16 90 top
R8  10.41,20.57 90 top
R9  76.45,19.56 180 top
R10  76.45,17.53 180 top
R11  61.72,16.76 90 top
R12  10.41,14.99 90 top
R13  68.33,13.21 0 top
R14  68.33,15.24 0 top
R15  86.87,32 0 top
R16  86.87,29.46 0 top
R17  86.87,26.92 0 top
R18  86.87,24.38 0 top
R19  86.87,21.84 0 top
R20  86.87,19.3 0 top
R21  86.87,16.76 0 top
R22  83.82,32 180 top
R23  83.82,29.46 180 top
R24  83.82,26.92 180 top
R25  83.82,24.38 180 top
R26  83.82,21.84 180 top
R27  83.82,19.3 180 top
R28  83.82,16.76 180 top
SW1  6.1,20.57 0 top
SW2  6.1,14.99 0 top
U1  45.21,24.13 180 top
U2  84.58,48.01 0 top
U3  75.18,48.01 0 top
U4  65.79,48.01 0 top
U5  69.85,19.3 90 top
U$1  3.3,35.31 0 top
U$2  76.71,8.64 0 top
U$3  29.72,36.58 0 top
X1  62.48,27.69 180 top

### Tracks (layer width: path | path; a pad name or v marks a point on that pad's centre or on a via)
1.2V  (via drill 0.5)
  Top 0.254: U1.116 39.96,15.92 v39.88,16 | v37.08,16 36.46,15.38 U1.109 36.46,12.15 35.99,11.68 31.74,11.68 C35.P$1 | v36.83,18.54 36.67,18.38 U1.102 31.58,18.38 C34.P$1 | v50.04,32.51 49.96,32.59 U1.45 49.96,36.25 50.8,37.08 C31.P$1 | v49.02,16 48.96,15.94 U1.134 48.96,12.13 48.26,11.43 47.75,11.43 47.24,10.92 C36.P$1 | v53.59,17.53 53.74,17.38 U1.5 58.06,17.38 58.42,17.02 C37.P$1 | v53.59,29.46 53.68,29.38 U1.29 57.57,29.38 58.42,30.23 C38.P$1 | v54.1,33.02 53.96,33.16 U1.37 53.96,35.93 54.61,36.58 C30.P$1 | v42.16,32.51 42.16,33.78 41.96,33.98 U1.61 41.96,36.78 41.66,37.08 41.66,37.35 C33.P$1 | C32.P$1 31.84,30.38 U1.78 35.21,30.38 35.81,30.99 v36.83,30.99
  Top 0.406: v65.79,49.28 U4.2 65.79,43.43 65.27,42.91 C20.P$1 C19.P$1 65.28,40.37 65.28,38.35 64.77,37.85 58.93,37.85 v55.63,34.54
  Bottom 0.406: v55.63,34.54 v54.1,33.02 53.59,32.51 | 53.59,32.51 v50.04,32.51 v42.16,32.51 37.34,32.51 36.83,32 v36.83,30.99 v36.83,18.54 36.83,16.26 v37.08,16 v39.88,16 | 53.59,32.51 v53.59,29.46 v53.59,17.53 53.59,16.51 53.09,16 v49.02,16
  other vias: 62.74,52.32 62.74,51.31 62.74,50.29 62.74,49.28 63.75,49.28 64.77,49.28 66.8,49.28 67.82,49.28 68.83,49.28 68.83,50.29 68.83,51.31 68.83,52.32 62.74,53.59 63.75,53.59 64.77,53.59 65.79,53.59 66.8,53.59 67.82,53.59 68.83,53.59
  pour Bottom: 61.98,55.12 61.98,44.7 69.6,44.7 69.6,55.12
  pour Top: 61.98,54.36 61.98,48.77 69.6,48.77 69.6,54.36
2.5V  (via drill 0.5)
  Top 0.254: C23.P$1 74.92,38.85 72.64,36.58 60.71,36.58 | 60.71,36.58 60.45,36.58 v59.94,36.07 | U1.35 59.55,32.38 C10.P$1 60.69,36.56 60.71,36.58 | v29.21,15.24 29.21,14.73 29.46,14.48 C18.P$1 29.97,15.24 30.23,15.49 33.02,15.49 33.41,15.88 U1.107
  Top 0.406: U3.2 v75.18,43.69 74.93,43.43 74.93,42.18 C17.P$1 C23.P$1
  Bottom 0.254: v59.94,36.07 33.78,36.07 29.21,31.5 v29.21,15.24
  Bottom 0.406: v75.18,49.28 v75.18,43.69
  other vias: 72.14,52.32 72.14,51.31 72.14,50.29 72.14,49.28 73.15,49.28 74.17,49.28 76.2,49.28 77.22,49.28 78.23,49.28 78.23,50.29 78.23,51.31 78.23,52.32 72.14,53.59 73.15,53.59 74.17,53.59 75.18,53.59 76.2,53.59 77.22,53.59 78.23,53.59
  pour Top: 71.37,54.36 71.37,48.77 78.99,48.77 78.99,54.36
  pour Bottom: 71.37,55.12 71.37,44.7 78.99,44.7 78.99,55.12
3.3V  (via drill 0.5)  (1 unrouted)
  Top 0.254: J2.P$2 36.35,46.51 v36.32,46.48 | J2.P$1 36.35,55.09 v36.32,55.12 | J2.P$3 34.35,55.06 v34.29,55.12 | U5.3 74.04,19.94 v74.17,20.07 | U5.8 64.64,17.4 v64.52,17.27 64.27,17.51 C22.P$1 | U5.7 65.41,18.67 v65.28,18.8 64.26,19.81 R4.P$1 | R7.P$1 10.41,23.88 v10.67,23.62 | R2.P$2 v78.23,28.96 | R5.P$1 10.41,29.21 v10.67,28.96 | R9.P$1 v78.23,19.56 | R10.P$1 v78.23,17.53 | R3.P$2 v78.23,34.04 | X1.P$4 62.48,27.74 62.48,29.48 C21.P$1 63.23,30.75 v62.74,31.24 | R11.P$1 v61.72,14.99 | U1.96 35.35,21.38 35.81,21.84 35.81,22.35 35.29,22.88 U1.93 31.78,22.88 31.48,22.58 C13.P$1 29.98,23.85 R6.P$1 | U1.17 58.93,23.38 C25.P$1 60.46,23.63 v60.45,23.62 | C26.P$1 51.46,11.06 U1.139 51.46,14.32 v51.05,14.73 | C27.P$1 38.1,10.17 38.1,10.92 38.61,11.43 39.62,11.43 40.46,12.27 U1.117 40.46,15.32 v40.89,15.75 | C6.P$1 44.46,37.59 U1.56 44.46,34.02 v44.96,33.53 | v41.4,33.53 41.46,33.59 U1.62 41.46,36.52 41.15,36.83 40.13,36.83 39.88,37.08 C5.P$1 | v42.67,14.73 42.96,14.44 U1.122 42.96,11.47 41.92,10.43 C28.P$1 | v52.58,33.53 52.46,33.64 U1.40 52.46,37.47 C3.P$1 | v49.28,33.53 48.96,33.84 U1.47 48.96,37.6 C4.P$1 | C1.P$1 31.81,28.88 U1.81 35.64,28.88 v36.07,29.21 | v46.48,14.73 46.96,14.25 U1.130 46.99,13.1 46.99,12.25 46.42,11.68 46.23,11.68 45.72,11.18 C29.P$1 | C2.P$1 58.42,28.7 57.6,27.88 U1.26 54.8,27.88 v54.61,27.69 | R8.P$1 10.41,19.05 v10.92,18.54 | R12.P$1 10.41,13.21 v10.92,12.7 | J1.4 65.28,26.42 v65.28,25.15
  Top 0.406: U2.2 84.58,43.69 84.33,43.43 84.33,42.18 C12.P$1 C7.P$1 84.32,39.13 v84.33,39.12
  Route15 0.254: v36.32,46.48 36.32,44.7 | v36.32,55.12 36.07,55.37 | v34.29,55.12 34.04,55.37 | v74.17,20.07 74.42,20.32 | v65.28,18.8 65.28,18.03 | v10.67,23.62 11.43,23.62 | v78.23,28.96 78.23,29.21 | v10.67,28.96 11.18,28.96 | v78.23,19.56 78.23,19.81 | v78.23,17.53 78.23,18.03 | v78.23,34.04 78.49,34.29 | v62.74,31.24 62.74,31.75 | v61.72,14.99 61.21,14.48 | v51.05,14.73 51.05,14.99 | v44.96,33.53 45.21,33.53 | v41.4,33.53 41.4,33.27 | v42.67,14.73 42.67,15.24 | v52.58,33.53 52.83,33.53 | v46.48,14.73 46.48,14.99 | v54.61,27.69 54.36,27.69 | v10.92,18.54 11.43,18.54 | v10.92,12.7 11.43,12.7 | v65.28,25.15 65.02,25.15
  Route15 0.406: v84.33,39.12 85.09,39.12
  other vias: 81.53,52.32 81.53,51.31 81.53,50.29 81.53,49.28 87.63,52.32 87.63,51.31 87.63,50.29 87.63,49.28 86.61,49.28 85.6,49.28 84.58,49.28 83.57,49.28 82.55,49.28 35.81,22.1 81.53,53.59 82.55,53.59 83.57,53.59 84.58,53.59 85.6,53.59 86.61,53.59 87.63,53.59
  pour Route15 (isolate 0.305, rank 6): 0,56.9 106.4,56.9 106.4,6.35 0,6.35
  pour Top: 80.77,54.36 80.77,48.77 88.39,48.77 88.39,54.36
  pour Bottom: 80.77,55.12 80.77,44.7 88.39,44.7 88.39,55.12
5V  (1 unrouted)
  Top 0.406: U3.3 C11.P$1 C15.P$1 | U4.3 C16.P$1 C24.P$1
  Top 0.813: 77.47,47.75 68.58,47.75 68.07,47.24 68.07,45.48 U4.3 | U3.3 77.48,47.74 77.47,47.75 | C8.P$1 U2.3 86.88,47.17 86.3,47.75 77.47,47.75 | C8.P$1 | C8.P$1 C14.P$1 86.88,36.32 | 86.88,36.32 86.88,36.08 86.87,36.07 | J7.3 97.48,44.76 99.06,43.18 99.06,37.34 97.79,36.07 87.13,36.07 86.88,36.32
12V
  Top 0.61: J7.2 95,52.58 91.95,55.63 56.56,55.63 | 56.56,55.63 55.37,55.63 54.56,54.82 J3.P$5 | J3.P$6 56.56,55.63
!CONFIG  (via drill 0.5)
  Top 0.254: v6.1,31.5 7.17,32.57 !CONFIG.P$2 10.09,32.57 R5.P$2 | U1.14 62.27,21.88 v62.48,22.1
  Bottom 0.254: v62.48,22.1 62.48,13.21 57.66,8.38 33.78,8.38 32.77,9.4 15.49,9.4 6.1,18.8 v6.1,31.5
!CSO
  Top 0.254: U5.1 70.23,17.4 69.6,18.03 65.02,18.03 64.18,18.88 61.72,18.88 | 61.72,18.88 U1.8 | R11.P$2 61.72,18.88
!STATUS
  Top 0.254: U1.9 60.02,19.38 60.45,19.81 R4.P$2
ASDO
  Top 0.254: U5.5 68.45,21.21 69.09,20.57 69.09,19.3 70.36,18.03 73.56,18.03 73.91,17.67 73.91,17.27 | 73.91,17.27 73.91,16.87 73.56,16.51 64.26,16.51 64.01,16.76 60.71,16.76 59.59,17.88 U1.6 | 73.91,17.27 75.45,17.27 R10.P$2
CLK_50
  Top 0.254: U1.25 57.71,27.38 58.18,26.91 X1.P$3
CLOCK
  Top 0.254: U1.144 53.96,12.33 54.36,11.94 79.5,11.94 79.76,12.19 79.76,29.97 80.52,30.73 83.82,30.73 84.57,31.48 R22.P$1 R15.P$1
CONF_DONE
  Top 0.254: U1.92 31.74,23.38 31.5,23.62 31.5,23.88 R6.P$2
DATA
  Top 0.254: U1.143 53.46,12.07 54.1,11.43 79.76,11.43 80.26,11.94 80.26,27.43 81.03,28.19 83.82,28.19 84.57,28.94 R23.P$1 R16.P$1
DATA0
  Top 0.254: U1.13 65.58,21.38 66.04,21.84 68.73,21.84 69.85,20.73 69.85,19.81 70.99,18.67 U5.2 74.04,18.67 74.93,19.56 R9.P$2
DCLK
  Top 0.254: U5.6 65.66,19.94 64.72,20.88 U1.12
ENABLE
  Top 0.254: U1.135 49.46,11.87 48.76,11.16 48.76,8.9 49.53,8.13 53.85,8.13 54.61,8.89 81.03,8.89 84.57,12.43 R28.P$1 R21.P$1
EVEN0+
  Top 0.254: J2.P$20 18.35,43.88 21.84,40.39 42.22,40.39 42.96,39.64 U1.59
EVEN0-
  Top 0.254: J2.P$19 18.35,51.37 17.27,50.29 17.27,44.2 21.59,39.88 42.07,39.88 42.46,39.49 U1.60
EVEN1+
  Top 0.254: J2.P$22 16.35,44.35 21.34,39.37 34.54,39.37 37.46,36.45 U1.70
EVEN1-
  Top 0.254: J2.P$21 16.35,51.4 15.49,50.55 15.49,44.45 21.08,38.86 34.29,38.86 36.96,36.19 U1.71
EVEN2+
  Top 0.254: J2.P$24 14.35,44.58 20.57,38.35 34.04,38.35 35.05,37.34 35.05,34.8 38.25,31.6 38.25,28.51 36.62,26.88 U1.85
EVEN2-
  Top 0.254: J2.P$23 14.35,51.44 13.46,50.55 13.46,44.7 20.32,37.85 33.78,37.85 34.54,37.08 34.54,34.54 37.67,31.42 37.67,28.73 36.32,27.38 U1.84
EVENC+
  Top 0.254: J2.P$28 10.35,38.16 12.7,35.81 12.7,16.66 20.48,8.89 40.64,8.89 41.15,9.4 41.15,10.86 41.72,11.43 42.16,11.43 42.46,11.73 U1.121
EVENC-
  Top 0.254: J2.P$27 11.43,51.85 11.43,47.24 10.92,46.74 10.92,38.35 13.21,36.07 13.21,16.94 20.75,9.4 40.39,9.4 40.64,9.65 40.64,11.02 41.56,11.94 41.66,11.94 41.96,12.24 U1.120
GND  (via drill 0.5)
  Top 0.254: J2.P$5 32.35,55.02 v32.26,55.12 | J2.P$6 32.35,46.58 v32.26,46.48 | J2.P$14 24.35,46.7 v24.13,46.48 | J2.P$13 24.35,54.9 v24.13,55.12 | J2.P$26 12.35,46.64 v12.19,46.48 | J2.P$25 12.35,54.96 v12.19,55.12 | U5.4 74.04,21.21 v74.17,21.34 | !CONFIG.P$4 8.17,29.17 v8.38,28.96 | !RESET.P$4 8.17,23.83 v8.38,23.62 | R1.P$1 v78.23,23.88 | X1.P$2 61.73,28.54 C21.P$2 61.73,31 v61.72,31.24 | C22.P$2 v63.5,14.99 | U1.95 32.26,21.88 | 32.26,21.88 32.26,21.34 | U1.94 32.51,22.38 32.26,22.12 32.26,21.88 | v60.2,25.15 60.19,25.13 C25.P$2 58.41,25.13 57.65,24.38 U1.19 55.12,24.38 54.86,24.64 54.86,25.38 | U1.21 54.86,25.38 | U1.22 55.09,25.88 54.86,25.65 54.86,25.38 | v52.32,14.73 51.96,14.37 U1.140 51.96,10.26 C26.P$2 | C27.P$2 39.62,10.17 39.62,10.67 40.96,12.01 U1.118 40.96,14.29 v41.4,14.73 | C30.P$2 v54.61,40.39 | C6.P$2 44.44,39.12 43.94,39.12 43.69,38.86 43.69,37.08 43.96,36.81 U1.57 43.96,34.06 v43.43,33.53 | v40.39,33.53 40.96,34.1 U1.63 40.96,36 40.64,36.32 39.62,36.32 39.12,36.83 39.12,38.86 39.37,39.12 39.87,39.12 C5.P$2 C33.P$2 | C37.P$2 58.92,15.51 57.54,16.88 U1.4 54.98,16.88 v54.61,16.51 | U1.36 58.55,32.88 C10.P$2 59.19,34.81 v59.44,35.05 | v43.94,14.73 43.46,14.25 U1.123 43.46,10.16 C28.P$2 | v48.26,33.53 48.46,33.73 U1.48 48.46,38.81 48.77,39.12 49.26,39.12 C4.P$2 C31.P$2 | v51.56,33.53 51.96,33.93 U1.41 51.96,36.43 51.56,36.83 51.56,38.86 51.8,39.1 C3.P$2 | C32.P$2 30.84,29.88 U1.79 35.65,29.88 v36.07,30.23 | C1.P$2 29.98,28.94 30.99,27.94 32.26,27.94 32.7,28.38 U1.82 35.88,28.38 v36.07,28.19 | C13.P$2 31,21.34 32.26,21.34 | v35.81,20.57 35.51,20.88 U1.97 33.22,20.88 32.77,21.34 32.26,21.34
  Top 0.254: v35.81,15.75 35.45,15.38 U1.108 33.67,15.38 33.27,14.99 32.26,14.99 31.75,14.48 C18.P$2 | v47.75,14.73 47.46,14.44 U1.131 47.46,11.9 46.48,10.92 46.48,9.66 | C29.P$2 46.48,9.66 | C36.P$2 46.48,9.66 | 59.68,29.46 58.42,29.46 57.34,28.38 U1.27 54.93,28.38 v54.61,28.68 | 59.68,29.46 C38.P$2 | C2.P$2 59.68,29.46 | J4.2 v96.01,32 | J4.4 v96.01,29.46 | J4.6 v96.01,26.92 | J4.8 v96.01,24.38 | J4.12 v96.01,19.3 | J4.10 v96.01,21.84 | J4.14 v96.01,16.76 | C34.P$2 v28.45,18.29 | SW1.P$4 8.17,18.5 v8.38,18.29 | SW2.P$4 8.17,12.91 v8.38,12.7 | C35.P$2 v28.7,11.94 | R27.P$2 83.83,20.07 86.36,20.07 v86.87,20.57 | R28.P$2 83.83,17.53 86.36,17.53 v86.87,18.03 | R26.P$2 83.83,22.61 86.36,22.61 v86.87,23.11 | R25.P$2 83.83,25.15 86.36,25.15 v86.87,25.65 | R24.P$2 83.83,27.69 86.36,27.69 v86.87,28.19 | R23.P$2 83.83,30.23 86.36,30.23 v86.87,30.73 | R22.P$2 83.83,32.77 86.36,32.77 v86.87,33.27 | D1.CATHODE v75.95,13.21 | D2.CATHODE v75.95,15.24 | J1.10 66.55,33.72 v66.55,32.77 | J1.2 66.55,23.88 v66.55,25.15
  Top 0.406: v72.9,43.43 73.42,42.91 C17.P$2 C23.P$2 | C23.P$2 | C14.P$2 C8.P$2 v88.38,43.42 v88.39,43.43 | v78.99,43.43 v78.98,43.42 C11.P$2 C15.P$2 | v69.6,43.43 69.58,43.42 C16.P$2 C24.P$2 | v82.8,39.12 82.82,39.13 C7.P$2 C12.P$2 | v82.3,43.43 82.8,42.93 82.8,42.16 | v63.5,43.43 63.77,43.17 C20.P$2 63.75,42.15 63.75,40.39 | C19.P$2 63.75,40.37 63.74,40.39 v62.74,40.39 | C23.P$2 73.41,40.39 v72.39,40.39
  Top 0.61: J3.P$2 48.56,54.61 v47.62,54.61 46.56,54.61 J3.P$1
  Top 0.813: U4.1 63.49,43.45 v63.5,43.43 | U3.1 72.88,43.45 v72.9,43.43 | U2.1 82.28,43.45 v82.3,43.43 | C9.P$2 arc90 82.04,36.48 v82.04,37.85
  Route2 0.254: v32.26,55.12 32,55.37 | v32.26,46.48 32.26,45.97 | v24.13,46.48 24.13,45.97 | v24.13,55.12 24.38,55.37 | v12.19,46.48 12.19,46.23 | v12.19,55.12 12.19,55.37 | 68.33,35.81 68.33,36.07 | v74.17,21.34 73.15,21.59 | v8.38,28.96 8.64,28.96 | v8.38,23.62 8.89,23.62 | v78.23,23.88 78.23,24.38 | v59.44,35.05 59.69,34.8 | v60.2,25.15 60.2,25.4 | v52.32,14.73 52.32,15.49 | v41.4,14.73 41.4,14.99 | v54.61,40.39 54.61,41.15 | v43.43,33.53 43.43,33.27 | 45.21,9.65 45.21,10.16 | v54.61,16.51 54.61,16 | v43.94,14.73 43.94,14.99 | v48.26,33.53 47.75,33.53 | v51.56,33.53 51.56,33.27 | v36.07,28.19 36.32,28.19 | v35.81,15.75 35.81,16.26 | v47.75,14.73 47.75,14.99 | v54.61,28.68 54.86,28.7 | v96.01,32 96.01,32.26 | v96.01,29.46 96.01,29.72 | v96.01,26.92 96.01,27.18 | v96.01,24.38 96.01,24.64 | v96.01,19.3 96.01,19.56 | v96.01,21.84 96.01,22.1 | v96.01,16.76 96.01,17.02 | v28.45,18.29 28.19,18.29 | v8.38,18.29 8.64,18.29 | v8.38,12.7 8.89,12.7 | v28.7,11.94 28.7,12.19 | v86.87,20.57 87.38,20.57 | v86.87,18.03 86.87,18.54 | v86.87,23.11 87.12,23.11 | v86.87,25.65 87.12,25.65 | v86.87,30.73 87.12,30.73 | v86.87,33.27 87.12,33.27 | v75.95,13.21 75.95,13.72 | v75.95,15.24 75.95,15.75 | v66.55,32.77 66.04,32.77
  Route2 0.406: v72.39,40.39 72.9,39.12 | v88.39,43.43 88.39,43.69 88.65,43.94 | v78.99,43.43 78.99,43.69 79.25,43.94 | v69.6,43.43 70.1,43.43 | v82.8,39.12 82.8,38.86 83.06,38.61 | v62.74,40.39 63.75,38.61
  Route2 0.813: v63.5,43.43 64.26,43.43 | v72.9,43.43 73.41,43.43 | v82.3,43.43 82.8,43.43 | v82.04,37.85 82.04,38.61
  other vias: 41.66,24.13 45.21,27.69 48.77,24.13 45.21,20.57 41.66,20.57 41.66,27.69 48.77,27.69 48.77,20.57 48.77,22.35 48.77,25.91 46.99,27.69 43.43,27.69 41.66,25.91 41.66,22.35 43.43,20.57 46.99,20.57
  pour Route2 (isolate 0.305, rank 6): 0,56.9 106.4,56.9 106.4,6.35 0,6.35
  pour Top: 41.15,28.19 41.15,20.07 49.28,20.07 49.28,28.19
LATCH
  Top 0.254: U1.142 52.96,11.81 53.85,10.92 80.01,10.92 80.77,11.68 80.77,24.89 81.53,25.65 83.82,25.65 84.57,26.4 R24.P$1 R17.P$1
LCD_PWR_M1
  Top 0.813: 42.67,52.58 45.21,52.58 | 44.2,54.61 44.2,50.29
  pour Top (isolate 0.305): 41.91,55.12 45.72,55.12 45.72,47.24 41.91,47.24
LCD_PWR_M2
  Top 0.813: 57.91,52.58 60.2,52.58 | 58.93,54.61 58.93,50.29
  pour Top (isolate 0.305): 57.4,55.12 61.21,55.12 61.21,47.24 57.4,47.24
N$1
  Top 0.254: R13.P$2 D1.ANODE
N$2
  Top 0.254: R14.P$2 D2.ANODE
N$3
  Top 0.254: R15.P$2 J4.1
N$4
  Top 0.254: R16.P$2 J4.3
N$5
  Top 0.254: R17.P$2 J4.5
N$6
  Top 0.254: J4.7 R18.P$2
N$7
  Top 0.254: R19.P$2 J4.9
N$8
  Top 0.254: R20.P$2 J4.11 93.22,19.3
N$9
  Top 0.254: J4.13 R21.P$2
ODD0+
  Top 0.254: J2.P$8 30.35,44.83 30.73,44.45 49.66,44.45 53.59,40.52 53.59,36.32 53.46,36.19 U1.38
ODD0-
  Top 0.254: J2.P$7 30.35,51.43 29.46,50.55 29.46,44.45 29.97,43.94 49.34,43.94 53.09,40.19 53.09,36.58 52.96,36.45 U1.39
ODD1+
  Top 0.254: J2.P$10 28.35,44.04 28.96,43.43 45.16,43.43 47.96,40.63 U1.49
ODD1-
  Top 0.254: J2.P$9 28.35,51.47 27.43,50.55 27.43,44.2 28.7,42.93 44.84,42.93 47.46,40.3 U1.50
ODD2+
  Top 0.254: J2.P$12 26.35,43.75 27.69,42.42 44.7,42.42 46.97,40.15 46.97,36.56 46.46,36.05 U1.52
ODD2-
  Top 0.254: J2.P$11 26.35,51.5 25.4,50.55 25.4,43.94 27.43,41.91 44.45,41.91 46.39,39.97 46.39,36.74 45.96,36.31 U1.53
ODDC+
  Top 0.254: J2.P$16 22.35,43.69 24.64,41.4 44.2,41.4 45.81,39.79 45.81,36.92 45.47,36.58 U1.54
ODDC-
  Top 0.254: J2.P$15 22.35,51.31 21.34,50.29 21.34,43.94 24.38,40.89 43.94,40.89 45.23,39.61 45.23,37.1 44.96,36.83 U1.55
PIN_1
  Top 0.254: U1.1 57.26,15.38 57.66,14.99 57.66,14.48 58.42,13.72 65.53,13.72 66.04,13.21 R13.P$1
PIN_2
  Top 0.254: U1.2 57.53,15.88 58.17,15.24 58.17,14.73 58.67,14.22 65.53,14.22 66.55,15.24 R14.P$1
PIN_73
  Top 0.254: U1.73 33.67,32.88 31.75,34.8 J5.P$1
PIN_74
  Top 0.254: U1.74 33.41,32.38 32.26,33.53 21.34,33.53 J6.P$1
PIN_75
  Top 0.254: U1.75 33.14,31.88 32.51,32.51 22.86,32.51 J5.P$2
PIN_76
  Top 0.254: U1.76 32.88,31.38 32.26,32 24.38,32 23.37,30.99 21.34,30.99 J6.P$2
PIN_77
  Top 0.254: U1.77 32.62,30.88 32,31.5 24.64,31.5 22.86,29.72 J5.P$3
PIN_83
  Top 0.254: U1.83 32.96,27.88 32.51,27.43 29.97,27.43 28.96,28.45 21.34,28.45 J6.P$3
PIN_86
  Top 0.254: U1.86 29.75,26.38 28.96,27.18 J5.P$4
PIN_87
  Top 0.254: J6.P$4 21.36,25.88 U1.87
PIN_88
  Top 0.254: U1.88 23.35,25.38 J5.P$5
PIN_89
  Top 0.254: U1.89 26.15,24.88 24.64,23.37 21.34,23.37 J6.P$5
PIN_98
  Top 0.254: J5.P$6 27.69,22.1 29.21,20.57 32.77,20.57 32.96,20.38 U1.98
PIN_99
  Top 0.254: J6.P$6 21.34,20.83 27.94,20.83 28.7,20.07 32.51,20.07 32.7,19.88 U1.99
PIN_100
  Top 0.254: U1.100 32.44,19.38 32.26,19.56 J5.P$7
PIN_101
  Top 0.254: U1.101 32.17,18.88 32,19.05 25.4,19.05 24.64,18.29 21.34,18.29 J6.P$7
PIN_103
  Top 0.254: U1.103 32.36,17.88 32,17.53 23.11,17.53 J5.P$8
PIN_104
  Top 0.254: U1.104 32.62,17.38 32.26,17.02 25.91,17.02 24.64,15.75 21.34,15.75 J6.P$8
PIN_105
  Top 0.254: U1.105 32.88,16.88 32.51,16.51 26.92,16.51 24.89,14.48 J5.P$9
PIN_106
  Top 0.254: U1.106 33.14,16.38 32.77,16 27.43,16 24.64,13.21 21.34,13.21 J6.P$9
PIN_110  (via drill 0.5)
  Top 0.254: SW1.P$2 10.09,21.65 R8.P$2 11.67,21.32 v11.68,21.34 | v34.8,10.67 35.81,10.67 36.96,11.82 U1.110
  Bottom 0.254: v11.68,21.34 11.68,17.53 18.54,10.67 v34.8,10.67
PIN_111  (via drill 0.5)
  Top 0.254: SW2.P$2 10.09,16.06 R12.P$2 10.43,15.75 12.45,15.75 v13.72,14.48 | v36.58,10.41 37.46,11.3 U1.111
  Bottom 0.254: v13.72,14.48 18.29,9.91 36.07,9.91 v36.58,10.41
PWM/EN  (via drill 0.5)
  Top 0.254: J3.P$4 52.56,46.5 v53.59,45.47 | v59.69,20.07 59.5,19.88 U1.10
  Bottom 0.254: v53.59,45.47 56.13,45.47 62.99,38.61 62.99,33.02 63.5,32.51 63.5,29.72 62.99,29.21 62.99,25.91 62.23,25.15 62.23,24.38 59.69,21.84 v59.69,20.07
REG0
  Top 0.254: U1.137 50.46,11.85 50.04,11.43 49.78,11.43 49.28,10.92 49.28,9.2 49.84,8.64 53.34,8.64 54.1,9.4 80.77,9.4 82.3,10.92 82.3,17.53 82.8,18.03 83.82,18.03 84.57,18.78 R27.P$1 R20.P$1
REG1
  Top 0.254: U1.138 50.96,11.59 50.29,10.92 50.04,10.92 49.78,10.67 49.78,9.4 50.04,9.14 52.83,9.14 53.59,9.91 80.52,9.91 81.79,11.18 81.79,19.81 82.55,20.57 83.82,20.57 84.57,21.32 R26.P$1 R19.P$1
REG2
  Top 0.254: U1.141 52.46,11.55 53.59,10.41 80.26,10.41 81.28,11.43 81.28,22.35 82.04,23.11 83.82,23.11 84.57,23.86 R25.P$1 R18.P$1
RESET
  Top 0.254: U1.125 44.46,11.44 44.45,11.43 44.45,9.86 42.97,8.38 10.26,8.38 6.1,12.55 6.1,26.16 7.17,27.24 !RESET.P$2 10.09,27.24 R7.P$2
TCK
  Top 0.254: U1.16 60.73,22.88 61.21,23.37 63.5,23.37 64.26,22.61 70.87,22.61 71.31,22.61 | R1.P$2 75.18,23.88 73.91,22.61 71.31,22.61 | 71.31,22.61 J1.1
TDI  (via drill 0.5)
  Top 0.254: U1.15 61.44,22.38 61.47,22.41 v61.47,22.61 | R3.P$1 75.18,34.04 73.66,35.56 v72.9,35.56 72.9,34.04 J1.9
  Bottom 0.254: v61.47,22.61 62.74,23.88 62.74,24.89 63.5,25.65 63.5,28.96 64.01,29.46 64.01,34.8 64.77,35.56 v72.9,35.56
TDO
  Top 0.254: U1.20 57.39,24.88 58.42,25.91 64.01,25.91 64.26,26.16 64.26,27.18 64.77,27.69 70.87,27.69 71.31,27.24 J1.3
TMS  (via drill 0.5)
  Top 0.254: U1.18 58.17,23.88 58.67,24.38 63.25,24.38 v63.5,24.64 | v71.37,30.23 71.37,28.96 J1.5 R2.P$1
  Bottom 0.254: v63.5,24.64 64.26,25.4 64.26,28.45 66.04,30.23 v71.37,30.23

### Text on the board
tPlace: PWR | LCD DATA | LCD POWER | PROG | DMD DATA